# Altium schematic sheet schematic-copy_2026-08-19.schdoc
size 312 x 214 mm
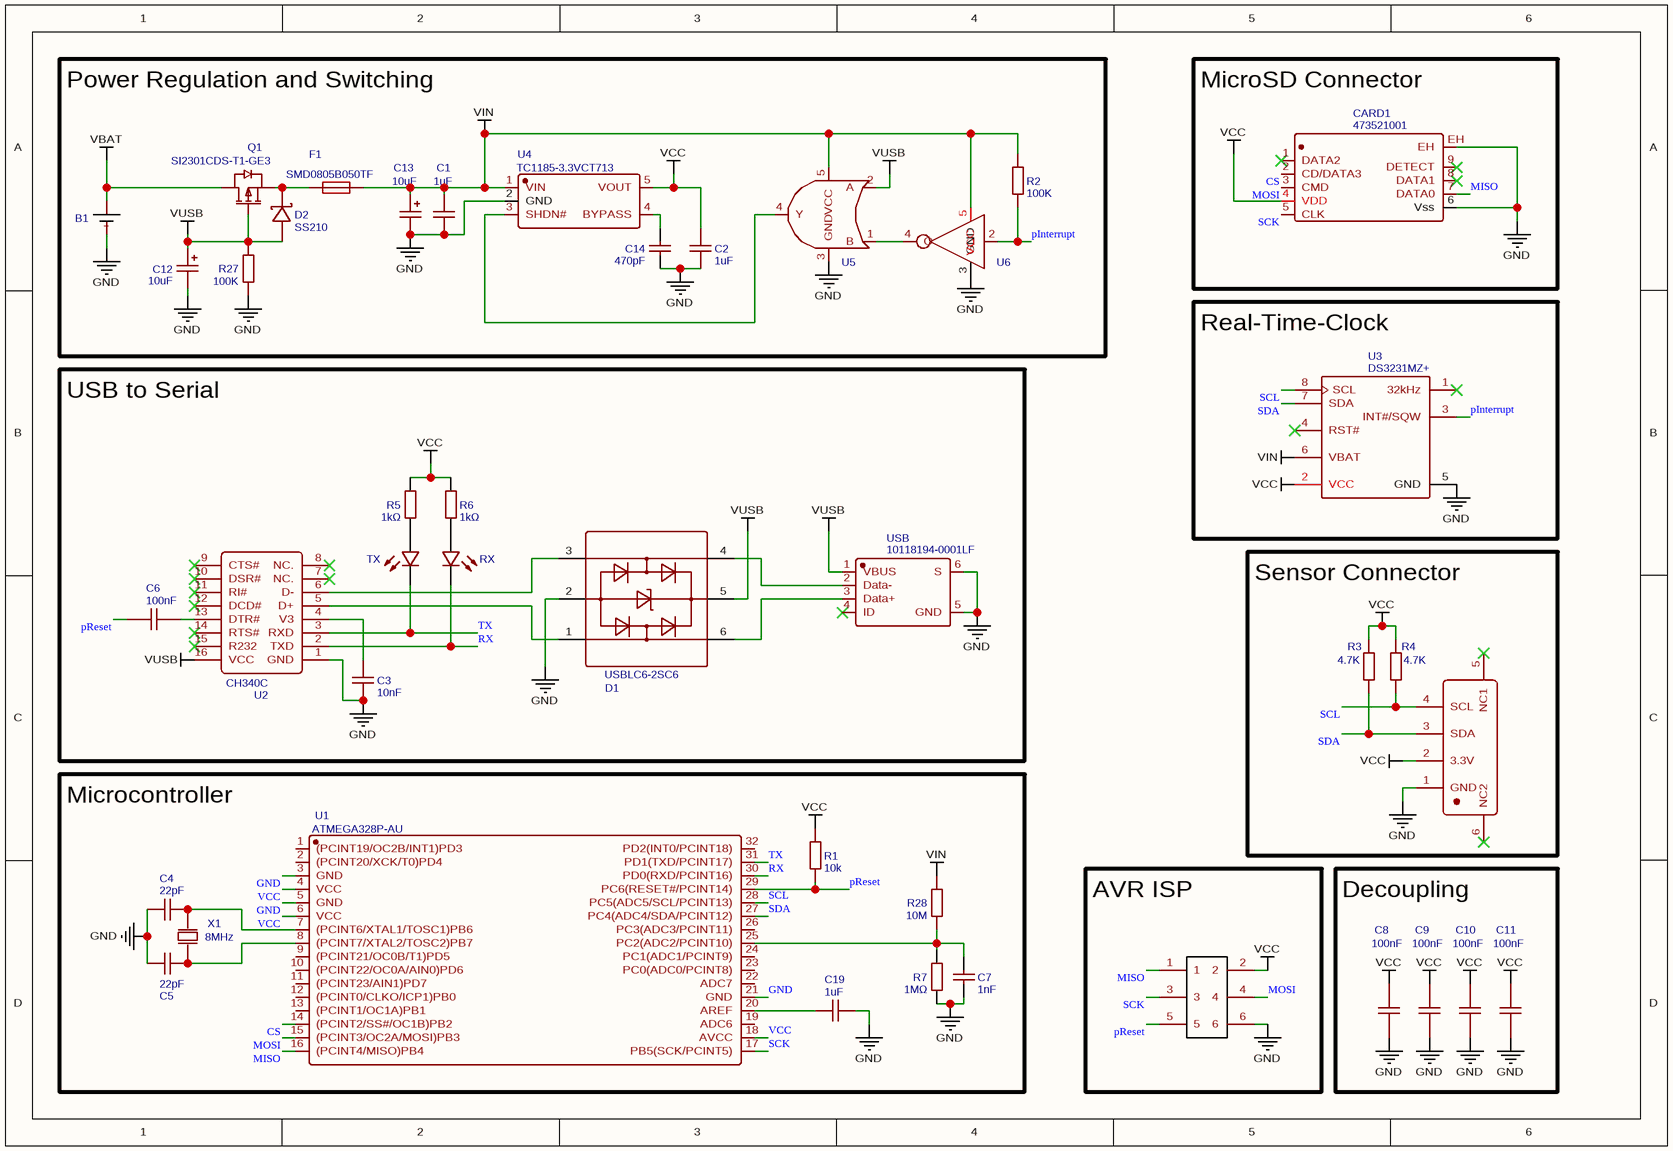
[diagram p0: schematic-copy_2026-08-19.schdoc]

## Parts
B1  KEYSTONE 2460 1XAA  [KEYSTONE 2460 1XAA]  (value not drawn)
C1  1uF  [C0603]
C2  1uF  [C0603]
C3  10nF  [C0603]
C4  22pF  [C0603]
C5  22pF  [C0603]
C6  100nF  [C0603]
C7  1nF  [C0603]
C8  100nF  [C0603]
C9  100nF  [C0603]
C10  100nF  [C0603]
C11  100nF  [C0603]
C12  10uF  [CAP-SMD_L3.2-W1.6-R-RD]
C13  10uF  [CAP-SMD_L3.2-W1.6-R-RD]
C14  470pF  [C0603]
C19  1uF  [C0603]
CARD1  473521001  [SD-SMD_SD-47352-101]
D1  USBLC6-2SC6  [SOT-23-6_L2.9-W1.6-P0.95-LS2.8-BR]
D2  SS210  [SMA_L4.3-W2.6-LS5.2-RD]
F1  SMD0805B050TF  [F0805]
ICSP  ICSP_2X3  [CON2X3]  (value not drawn)
Q1  SI2301CDS-T1-GE3  [SOT-23-3_L3.0-W1.7-P0.95-LS2.9-BR]
R1  10k  [R0603]
R2  100K  [R0603]
R3  4.7K  [R0603]
R4  4.7K  [R0603]
R5  1kΩ  [R0603]
R6  1kΩ  [R0603]
R7  1MΩ  [R0603]
R27  100K  [R0603]
R28  10M  [R0603]
RX  19-213/Y2C-CQ2R2L/3T(CY)  [LED0603-R-RD]  (value not drawn)
TX  19-213/Y2C-CQ2R2L/3T(CY)  [LED0603-R-RD]  (value not drawn)
U1  ATMEGA328P-AU  [TQFP-32_L7.0-W7.0-P0.80-LS9.0-BL]
U2  CH340C  [SOP-16_L10.0-W3.9-P1.27-LS6.0-BL]
U3  DS3231MZ+  [SOIC-8_L4.9-W3.9-P1.27-LS6.0-BL]
U4  TC1185-3.3VCT713  [SOT-23-5_L3.0-W1.7-P0.95-LS2.8-BR]
U5  74AHC1G32GW,125  [SOT-353_L2.2-W1.4-P0.65-LS2.4-BR]  (value not drawn)
U6  SN74LVC1G14DCKR  [SC-70-5_L2.1-W1.3-P0.65-LS2.1-BR]  (value not drawn)
U11  QWIIC  [QWIIC CONNECTOR]  (value not drawn)
USB  10118194-0001LF  [MICRO-USB-SMD_10118194-0001LF]
X1  8MHz  [CRYSTAL-SMD_L5.0-W3.2]

## Blocks framed on the sheet
Power Regulation and Switching: B1 C1 C2 C12-C14 D2 F1 Q1 R2 R27 U4-U6
MicroSD Connector: CARD1
Real-Time-Clock: U3
USB to Serial: C3 C6 D1 R5 R6 RX TX U2 USB
Sensor Connector: R3 R4 U11
Microcontroller: C4 C5 C7 C19 R1 R7 R28 U1 X1
AVR ISP: ICSP
Decoupling: C8-C11

## Nets
GND: B1.2(-) C1.1 C2.2 C3.2 C4.2 C5.1 C7.1 C8.1 C9.1 C10.1 C11.1 C12.2 C13.2 C14.1 C19.1 CARD1.6(Vss) CARD1.EH D1.2 ICSP.6 R7.1 R27.1 U1.3(GND) U1.5(GND) U1.21(GND) U2.1(GND) U3.5(GND) U4.2(GND) U5.3(GND) U6.3(GND) U11.1(GND) USB.5(GND) USB.6(S)
VBAT: B1.1(+) Q1.3(D)
VCC: C2.1 C8.2 C9.2 C10.2 C11.2 CARD1.4(VDD) ICSP.2 R1.2 R3.2 R4.2 R5.2 R6.2 U1.4(VCC) U1.6(VCC) U1.18(AVCC) U3.2(VCC) U4.5(VOUT) U11.2(3.3V)
VIN: C1.2 C13.1 F1.2 R2.2 R28.2 U3.6(VBAT) U4.1(VIN) U5.5(VCC) U6.5(VCC)
VUSB: C12.1 D1.5 D2.2(A) Q1.1(G) R27.2 U2.16(VCC) U5.2(A) USB.1(VBUS)
CS: CARD1.2(CD/DATA3) U1.14((PCINT2/SS#/OC1B)PB2)
MISO: CARD1.7(DATA0) ICSP.1 U1.16((PCINT4/MISO)PB4)
MOSI: CARD1.3(CMD) ICSP.4 U1.15((PCINT3/OC2A/MOSI)PB3)
pInterrupt: R2.1 U3.3(INT#/SQW) U6.2(I)
pReset: C6.2 ICSP.5 R1.1 U1.29(PC6(RESET#/PCINT14))
RX: RX.2(C) U1.30(PD0(RXD/PCINT16)) U2.2(TXD)
SCK: CARD1.5(CLK) ICSP.3 U1.17(PB5(SCK/PCINT5))
SCL: R4.1 U1.28(PC5(ADC5/SCL/PCINT13)) U3.8(SCL) U11.4(SCL)
SDA: R3.1 U1.27(PC4(ADC4/SDA/PCINT12)) U3.7(SDA) U11.3(SDA)
TX: TX.2(C) U1.31(PD1(TXD/PCINT17)) U2.3(RXD)
NetC3_1: C3.1 U2.4(V3)
NetC4_1: C4.1 U1.7((PCINT6/XTAL1/TOSC1)PB6) X1.2(OSC2)
NetC5_2: C5.2 U1.8((PCINT7/XTAL2/TOSC2)PB7) X1.1(OSC1)
NetC6_1: C6.1 U2.13(DTR#)
NetC7_2: C7.2 R7.2 R28.1 U1.25(PC2(ADC2/PCINT10))
NetC14_2: C14.2 U4.4(BYPASS)
NetC19_2: C19.2 U1.20(AREF)
NetD1_1: D1.1 U2.5(D+)
NetD1_3: D1.3 U2.6(D-)
NetD1_4: D1.4 USB.2(Data-)
NetD1_6: D1.6 USB.3(Data+)
NetD2_1: D2.1(K) F1.1 Q1.2(S)
NetR5_1: R5.1 TX.1(A)
NetR6_1: R6.1 RX.1(A)
NetU4_3: U4.3(SHDN#) U5.4(Y)
NetU5_1: U5.1(B) U6.4(O)

Not connected (* = marked no-connect by the designer): CARD1 1(DATA2)* 8(DATA1)* 9(DETECT)*; U1 1((PCINT19/OC2B/INT1)PD3) 2((PCINT20/XCK/T0)PD4) 9((PCINT21/OC0B/T1)PD5) 10((PCINT22/OC0A/AIN0)PD6) 11((PCINT23/AIN1)PD7) 12((PCINT0/CLKO/ICP1)PB0) 13((PCINT1/OC1A)PB1) 19(ADC6) 22(ADC7) 23(PC0(ADC0/PCINT8)) 24(PC1(ADC1/PCINT9)) 26(PC3(ADC3/PCINT11)) 32(PD2(INT0/PCINT18)); U2 7(NC.)* 8(NC.)* 9(CTS#)* 10(DSR#)* 11(RI#)* 12(DCD#)* 14(RTS#)* 15(R232)*; U3 1(32kHz)* 4(RST#)*; U11 5(NC1)* 6(NC2)*; USB 4(ID)*

## Library data of the parts
B1 = KEYSTONE 2460 1XAA: Manufacturer: Keystone Electronics; Manufacturer Part: 2460; Contributor: montezuma1970; Supplier: Digi-Key; Supplier Part: 36-2460-ND; link: https://uk.farnell.com/keystone/2460/battery-holder/dp/1702629; spicePre: B; spiceSymbolName: KEYSTONE 2460 1XAA
C1 C2 C19 = 1uF: Manufacturer Part: CL10A105KB8NNNC; Manufacturer: SAMSUNG; nameAlias: Capacitance; SMT Type: Basic; Paste Type: base; Supplier: LCSC; Supplier Part: C15849; JLCPCB SMD: Yes; LCSC Assembly: Yes; spicePre: C; spiceSymbolName: CL10A105KB8NNNC
C3 = 10nF: Manufacturer: FH(风华); Manufacturer Part: 0603B103K500NT; nameAlias: Capacitance; Supplier: LCSC; Supplier Part: C57112; JLCPCB Part Class: Basic Part; spicePre: C; spiceSymbolName: 0603B103K500NT
C4 C5 = 22pF: Manufacturer Part: CL10C220JB8NNNC; Manufacturer: SAMSUNG; nameAlias: Capacitance; SMT Type: Basic; Paste Type: base; Supplier: LCSC; Supplier Part: C1653; JLCPCB SMD: Yes; LCSC Assembly: Yes; spicePre: C; spiceSymbolName: CL10C220JB8NNNC
C6 = 100nF: Manufacturer: YAGEO; Manufacturer Part: CC0603KRX7R9BB104; nameAlias: Capacitance; Supplier: LCSC; Supplier Part: C14663; JLCPCB Part Class: Basic Part; spicePre: C; spiceSymbolName: CC0603KRX7R9BB104
C7 = 1nF: Manufacturer Part: CL10B102KB8NNNC; Manufacturer: SAMSUNG(三星); nameAlias: Capacitance; Supplier: LCSC; Supplier Part: C1588; JLCPCB Part Class: Basic Part; spicePre: C; spiceSymbolName: CL10B102KB8NNNC
C8-C11 = 100nF: Manufacturer: YAGEO; Manufacturer Part: CC0603KRX7R9BB104; nameAlias: Capacitance; SMT Type: Basic; Paste Type: base; Supplier: LCSC; Supplier Part: C14663; JLCPCB SMD: Yes; LCSC Assembly: Yes; spicePre: C; spiceSymbolName: CC0603KRX7R9BB104
C12 C13 = 10uF: Manufacturer: AVX; Manufacturer Part: TAJA106K016RNJ; nameAlias: Capacitance; SMT Type: Basic; Paste Type: base; Supplier: LCSC; Supplier Part: C7171; JLCPCB SMD: Yes; spicePre: C; spiceSymbolName: TAJA106K016RNJ
C14 = 470pF: Manufacturer: FH(风华); Manufacturer Part: 0603B471K500NT; nameAlias: Capacitance; Supplier: LCSC; Supplier Part: C1620; JLCPCB Part Class: Basic Part; spicePre: C; spiceSymbolName: 0603B471K500NT
CARD1 = 473521001: Manufacturer: MOLEX; Contributor: LCSC; Supplier: LCSC; Supplier Part: C293569; Manufacturer Part: 473521001; JLCPCB Part Class: Extended Part; spicePre: C; spiceSymbolName: 473521001
D1 = USBLC6-2SC6: Manufacturer: ST(意法半导体); Supplier: LCSC; Manufacturer Part: USBLC6-2SC6; Supplier Part: C7519; JLCPCB Part Class: Extended Part; spicePre: D; spiceSymbolName: USBLC6-2SC6
D2 = SS210: Manufacturer: MDD; SMT Type: Basic; Paste Type: base; Supplier: LCSC; Manufacturer Part: SS210; image: //image.lceda.cn/szlcsc/C14996.jpg; Supplier Part: C14996; JLCPCB SMD: Yes; LCSC Assembly: Yes; spicePre: D; spiceSymbolName: SS210
F1 = SMD0805B050TF: Manufacturer: Brightking(君耀电子); Contributor: LCSC; Supplier: LCSC; Supplier Part: C269104; Manufacturer Part: SMD0805B050TF; JLCPCB Part Class: Extended Part; spicePre: U; spiceSymbolName: SMD0805B050TF
ICSP = ICSP_2X3: Contributor: hvergelmir.eed04; spicePre: U; spiceSymbolName: ICSP_2X3
Q1 = SI2301CDS-T1-GE3: Manufacturer: VISHAY; SMT Type: Basic; Paste Type: base; Supplier: LCSC; Manufacturer Part: SI2301CDS-T1-GE3; image: //image.lceda.cn/szlcsc/C10487.jpg; Supplier Part: C10487; JLCPCB SMD: Yes; LCSC Assembly: Yes; spicePre: Q; spiceSymbolName: SI2301CDS-T1-GE3
R1 = 10k: Manufacturer: UniOhm; Manufacturer Part: 0603WAF1002T5E; nameAlias: Resistance; Supplier: LCSC; Supplier Part: C25804; Resistance (Ohms): 10K; JLCPCB Part Class: Basic Part; spicePre: R; spiceSymbolName: 0603WAF1002T5E
R2 R27 = 100K: Manufacturer: UniOhm; Manufacturer Part: 0603WAF1003T5E; nameAlias: Resistance (Ohms); SMT Type: Basic; Paste Type: base; Supplier: LCSC; Supplier Part: C25803; JLCPCB SMD: Yes; LCSC Assembly: Yes; spicePre: R; spiceSymbolName: 0603WAF1003T5E
R3 R4 = 4.7K: Manufacturer: UniOhm; Manufacturer Part: 0603WAF4701T5E; nameAlias: Resistance (Ohms); SMT Type: Basic; Paste Type: base; Supplier: LCSC; Supplier Part: C23162; JLCPCB SMD: Yes; LCSC Assembly: Yes; spicePre: R; spiceSymbolName: 0603WAF4701T5E
R5 R6 = 1kΩ: Manufacturer: UNI-ROYAL(厚声); Manufacturer Part: 0603WAF1001T5E; nameAlias: Resistance; Resistance (Ohms): 1K; Supplier: LCSC; Supplier Part: C21190; JLCPCB Part Class: Basic Part; spicePre: R; spiceSymbolName: 0603WAF1001T5E
R7 = 1MΩ: Manufacturer: UNI-ROYAL(厚声); Manufacturer Part: 0603WAF1004T5E; nameAlias: Resistance; Resistance (Ohms): 1M; Supplier: LCSC; Supplier Part: C22935; JLCPCB Part Class: Basic Part; spicePre: R; spiceSymbolName: 0603WAF1004T5E
R28 = 10M: Manufacturer: UniOhm; Manufacturer Part: 0603WAF1005T5E; nameAlias: Resistance (Ohms); SMT Type: Basic; Paste Type: base; Supplier: LCSC; Supplier Part: C7250; JLCPCB SMD: Yes; LCSC Assembly: Yes; spicePre: R; spiceSymbolName: 0603WAF1005T5E
RX TX = 19-213/Y2C-CQ2R2L/3T(CY): Manufacturer: EVERLIGHT(亿光); Supplier: LCSC; Manufacturer Part: 19-213/Y2C-CQ2R2L/3T(CY); Supplier Part: C72038; JLCPCB Part Class: Basic Part; spicePre: L; spiceSymbolName: 19-213/Y2C-CQ2R2L/3T(CY)
U1 = ATMEGA328P-AU: Manufacturer: MICROCHIP; Supplier: LCSC; Manufacturer Part: ATMEGA328P-AU; Supplier Part: C14877; JLCPCB Part Class: Basic Part; spicePre: U; spiceSymbolName: ATMEGA328P-AU
U2 = CH340C: Manufacturer: WCH; Supplier: LCSC; Manufacturer Part: CH340C; Supplier Part: C84681; JLCPCB Part Class: Extended Part; spicePre: U; spiceSymbolName: CH340C
U3 = DS3231MZ+: Manufacturer: MAXIM(美信); Manufacturer Part: DS3231MZ+TRL; Supplier: LCSC; Supplier Part: C107410; JLCPCB Part Class: Extended Part; spicePre: U; spiceSymbolName: DS3231MZ+
U4 = TC1185-3.3VCT713: Manufacturer: MICROCHIP(美国微芯); Supplier: LCSC; Manufacturer Part: TC1185-3.3VCT713; Supplier Part: C53703; JLCPCB Part Class: Extended Part; spicePre: U; spiceSymbolName: TC1185-3.3VCT713
U5 = 74AHC1G32GW,125: Manufacturer: Nexperia; Contributor: Ted Langhorst; Supplier: LCSC; Manufacturer Part: 74AHC1G32GW,125; Supplier Part: C12489; JLCPCB Part Class: Extended Part; spicePre: U; spiceSymbolName: 74AHC1G32GW,125
U6 = SN74LVC1G14DCKR: Manufacturer: TI(德州仪器); spicePre: X; Supplier: LCSC; Manufacturer Part: SN74LVC1G14DCKR; Supplier Part: C35740; JLCPCB Part Class: Extended Part; spiceSymbolName: SN74LVC1G14DCKR
U11 = QWIIC: Manufacturer: JST Sales America; Contributor: donhagen; Supplier: Sparkfun; Supplier Part: PRT-14417; link: https://www.sparkfun.com/products/14417; spicePre: U; spiceSymbolName: QWIIC SMD JST
USB = 10118194-0001LF: Manufacturer: Amphenol ICC; Contributor: LCSC; Supplier: LCSC; Supplier Part: C132563; Manufacturer Part: 10118194-0001LF; JLCPCB Part Class: Extended Part; spicePre: U; spiceSymbolName: 10118194-0001LF
X1 = 8MHz: Manufacturer: YXC; Manufacturer Part: X50328MSB2GI; nameAlias: Frequency; Supplier: LCSC; Supplier Part: C115962; JLCPCB Part Class: Basic Part; spicePre: X; spiceSymbolName: X50328MSB2GI